# Altium schematic sheet esp32_v2.SchDoc
size A3
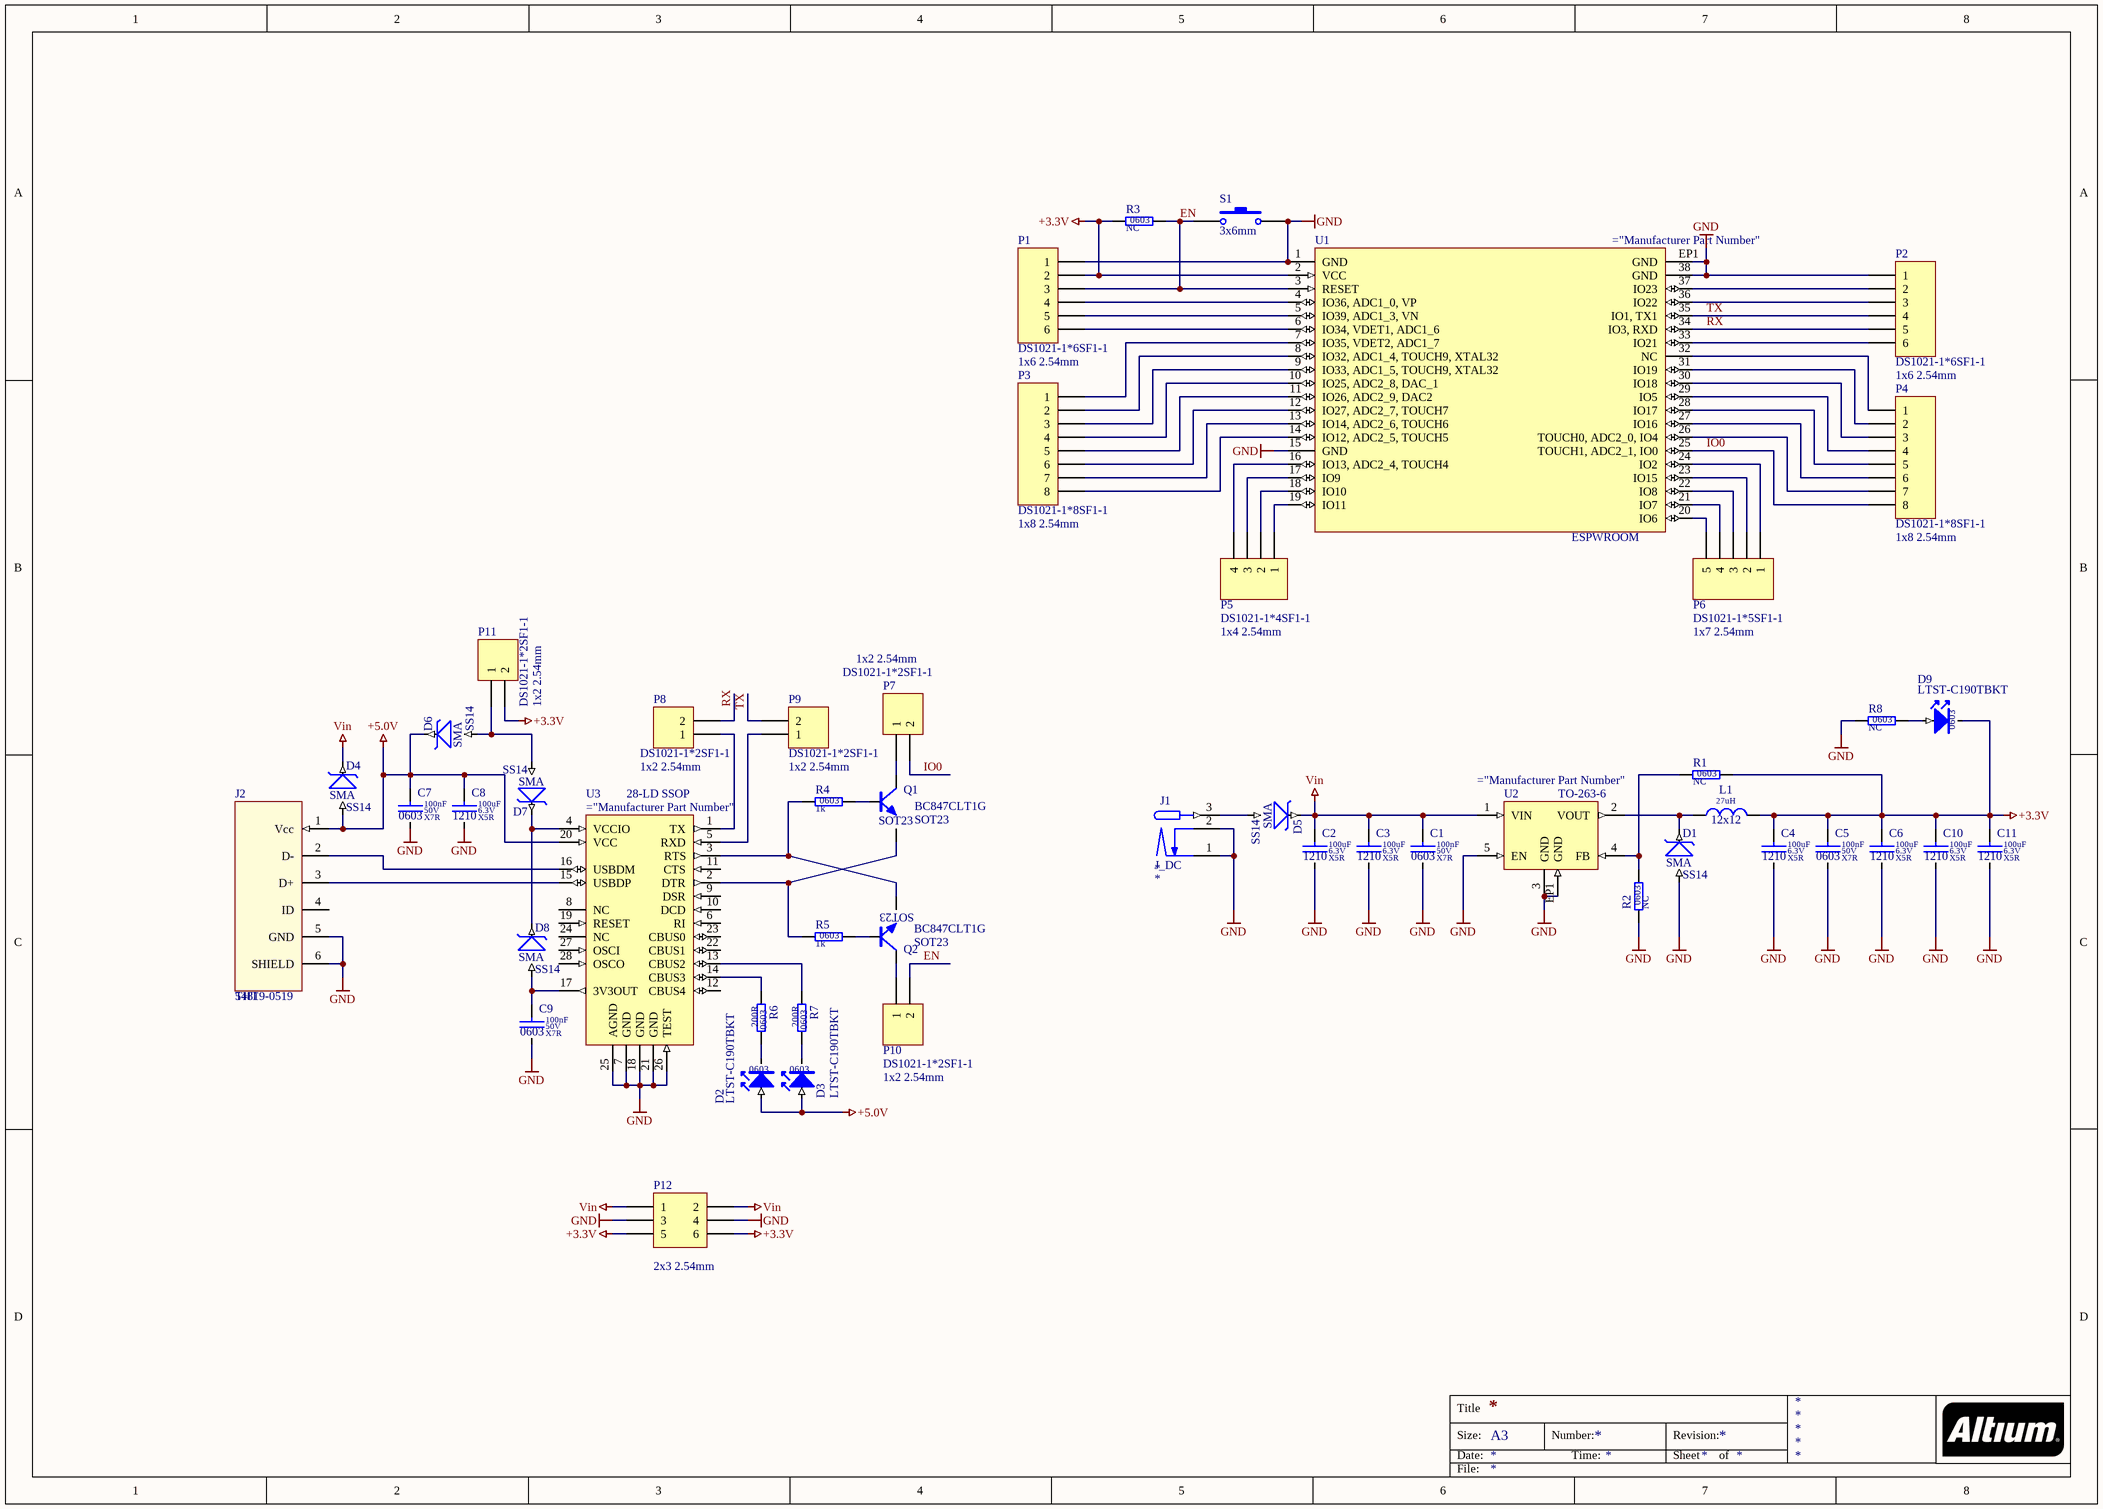
[diagram p0: esp32_v2.SchDoc]

## Parts
C1  value 100nF  Dielectric: X7R  Voltage: 50V  SCH_Footprint: 0603  [C_0603_1608]  (hidden comment: Ceramic X7R)
C2  value 100uF  Dielectric: X5R  Voltage: 6.3V  SCH_Footprint: 1210  [C_1210_3225]  (hidden comment: Ceramic X5R)
C3  value 100uF  Dielectric: X5R  Voltage: 6.3V  SCH_Footprint: 1210  [C_1210_3225]  (hidden comment: Ceramic X5R)
C4  value 100uF  Dielectric: X5R  Voltage: 6.3V  SCH_Footprint: 1210  [C_1210_3225]  (hidden comment: Ceramic X5R)
C5  value 100nF  Dielectric: X7R  Voltage: 50V  SCH_Footprint: 0603  [C_0603_1608]  (hidden comment: Ceramic X7R)
C6  value 100uF  Dielectric: X5R  Voltage: 6.3V  SCH_Footprint: 1210  [C_1210_3225]  (hidden comment: Ceramic X5R)
C7  value 100nF  Dielectric: X7R  Voltage: 50V  SCH_Footprint: 0603  [C_0603_1608]  (hidden comment: Ceramic X7R)
C8  value 100uF  Dielectric: X5R  Voltage: 6.3V  SCH_Footprint: 1210  [C_1210_3225]  (hidden comment: Ceramic X5R)
C9  value 100nF  Dielectric: X7R  Voltage: 50V  SCH_Footprint: 0603  [C_0603_1608]  (hidden comment: Ceramic X7R)
C10  value 100uF  Dielectric: X5R  Voltage: 6.3V  SCH_Footprint: 1210  [C_1210_3225]  (hidden comment: Ceramic X5R)
C11  value 100uF  Dielectric: X5R  Voltage: 6.3V  SCH_Footprint: 1210  [C_1210_3225]  (hidden comment: Ceramic X5R)
D1  SCH_Footprint: SMA  [SMA_DO-214AC]  (hidden comment: SS14)
D2  value LTST-C190TBKT  SCH_Footprint: 0603  [OL_0603_1608]  (hidden comment: Blue Led)
D3  value LTST-C190TBKT  SCH_Footprint: 0603  [OL_0603_1608]  (hidden comment: Blue Led)
D4  SCH_Footprint: SMA  [SMA_DO-214AC]  (hidden comment: SS14)
D5  SCH_Footprint: SMA  [SMA_DO-214AC]  (hidden comment: SS14)
D6  SCH_Footprint: SMA  [SMA_DO-214AC]  (hidden comment: SS14)
D7  SCH_Footprint: SMA  [SMA_DO-214AC]  (hidden comment: SS14)
D8  SCH_Footprint: SMA  [SMA_DO-214AC]  (hidden comment: SS14)
D9  value LTST-C190TBKT  SCH_Footprint: 0603  [OL_0603_1608]  (hidden comment: Blue Led)
J1  J_DC  [DC_5.5]
J2  value 54819-0519  SCH_Footprint: THT  [J_USB_MINIB_54819-0519_THT]  (hidden comment: USB connector)
L1  value 27uH  SCH_Footprint: 12x12  [L_SRR1280-XXXY]  (hidden comment: Inductor)
P1  value DS1021-1*6SF1-1  SCH_Footprint: 1x6 2.54mm  [P_HEADER_1x6_2.54]  (hidden comment: Goldpin)
P2  value DS1021-1*6SF1-1  SCH_Footprint: 1x6 2.54mm  [P_HEADER_1x6_2.54]  (hidden comment: Goldpin)
P3  value DS1021-1*8SF1-1  SCH_Footprint: 1x8 2.54mm  [P_HEADER_1x8_2.54]  (hidden comment: Goldpin)
P4  value DS1021-1*8SF1-1  SCH_Footprint: 1x8 2.54mm  [P_HEADER_1x8_2.54]  (hidden comment: Goldpin)
P5  value DS1021-1*4SF1-1  SCH_Footprint: 1x4 2.54mm  [P_HEADER_1x4_2.54]  (hidden comment: Goldpin)
P6  value DS1021-1*5SF1-1  SCH_Footprint: 1x7 2.54mm  [P_HEADER_1x5_2.54]  (hidden comment: Goldpin)
P7  value DS1021-1*2SF1-1  SCH_Footprint: 1x2 2.54mm  [P_HEADER_1x2_2.54]  (hidden comment: Goldpin)
P8  value DS1021-1*2SF1-1  SCH_Footprint: 1x2 2.54mm  [P_HEADER_1x2_2.54]  (hidden comment: Goldpin)
P9  value DS1021-1*2SF1-1  SCH_Footprint: 1x2 2.54mm  [P_HEADER_1x2_2.54]  (hidden comment: Goldpin)
P10  value DS1021-1*2SF1-1  SCH_Footprint: 1x2 2.54mm  [P_HEADER_1x2_2.54]  (hidden comment: Goldpin)
P11  value DS1021-1*2SF1-1  SCH_Footprint: 1x2 2.54mm  [P_HEADER_1x2_2.54]  (hidden comment: Goldpin)
P12  SCH_Footprint: 2x3 2.54mm  [P_HEADER_2x3_2.54]  (hidden comment: Goldpin)
Q1  value BC847CLT1G  SCH_Footprint: SOT23  [SOT23_TO236_SC59]  (hidden comment: BC847C)
Q2  value BC847CLT1G  SCH_Footprint: SOT23  [SOT23_TO236_SC59]  (hidden comment: BC847C)
R1  value NC  SCH_Footprint: 0603  [R_NC_0603_1608]  (hidden comment: Resistor)
R2  value NC  SCH_Footprint: 0603  [R_NC_0603_1608]  (hidden comment: Resistor)
R3  value NC  SCH_Footprint: 0603  [R_NC_0603_1608]  (hidden comment: Resistor)
R4  value 1k  SCH_Footprint: 0603  [R_0603_1608]  (hidden comment: Resistor)
R5  value 1k  SCH_Footprint: 0603  [R_0603_1608]  (hidden comment: Resistor)
R6  value 200R  SCH_Footprint: 0603  [R_0603_1608]  (hidden comment: Resistor)
R7  value 200R  SCH_Footprint: 0603  [R_0603_1608]  (hidden comment: Resistor)
R8  value NC  SCH_Footprint: 0603  [R_NC_0603_1608]  (hidden comment: Resistor)
S1  3x6mm  [S_TACTSWITCH3x6]
U1  SCH_Footprint: ESPWROOM  [ESP_WROOM_32]  (hidden comment: U_ESP32)
U2  VR_LM2596  [TO-263-6]  (value not drawn)
U3  SCH_Footprint: 28-LD SSOP  [SSOP28_5X10X17]  (hidden comment: U_FT232RL)

## Nets
+3.3V: C4.1 C5.1 C6.1 C10.1 C11.1 D9.1(K) L1.2 P1.2 P11.2 P12.5 P12.6 R1.2 R3.1 U1.2(VCC)
+5.0V: C7.1 C8.1 D2.2(A) D3.2(A) D4.2 D6.1 J2.1(Vcc) U3.20(VCC)
GND: C1.2 C2.2 C3.2 C4.2 C5.2 C6.2 C7.2 C8.2 C9.2 C10.2 C11.2 D1.2 J1.1 J1.2 J2.5(GND) J2.6(SHIELD) P1.1 P2.1 P12.3 P12.4 R2.1 R8.1 S1.2 U1.1(GND) U1.15(GND) U1.38(GND) U1.EP1(GND) U2.3(GND) U2.5(EN) U2.EP1(GND) U3.7(GND) U3.18(GND) U3.21(GND) U3.25(AGND) U3.26(TEST)
Vin: C1.1 C2.1 C3.1 D4.1 D5.1 P12.1 P12.2 U2.1(VIN)
EN: P1.3 P10.2 R3.2 S1.1 U1.3(RESET)
IO0: P4.8 P7.2 U1.25(TOUCH1,_ADC2_1,_IO0)
RX: P2.5 P8.2 U1.34(IO3,_RXD)
TX: P2.4 P9.2 U1.35(IO1,_TX1)
NetC9_1: C9.1 D8.2 U3.17(3V3OUT)
NetD1_1: D1.1 L1.1 U2.2(VOUT)
NetD2_1: D2.1(K) R6.2
NetD3_1: D3.1(K) R7.2
NetD5_2: D5.2 J1.3
NetD6_2: D6.2 D7.2 P11.1
NetD7_1: D7.1 D8.1 U3.4(VCCIO)
NetD9_2: D9.2(A) R8.2
NetJ2_2: J2.2(D-) U3.16(USBDM)
NetJ2_3: J2.3(D+) U3.15(USBDP)
NetP1_4: P1.4 U1.4(IO36,_ADC1_0,_VP)
NetP1_5: P1.5 U1.5(IO39,_ADC1_3,_VN)
NetP1_6: P1.6 U1.6(IO34,_VDET1,_ADC1_6)
NetP2_2: P2.2 U1.37(IO23)
NetP2_3: P2.3 U1.36(IO22)
NetP2_6: P2.6 U1.33(IO21)
NetP3_1: P3.1 U1.7(IO35,_VDET2,_ADC1_7)
NetP3_2: P3.2 U1.8(IO32,_ADC1_4,_TOUCH9,_XTAL32)
NetP3_3: P3.3 U1.9(IO33,_ADC1_5,_TOUCH9,_XTAL32)
NetP3_4: P3.4 U1.10(IO25,_ADC2_8,_DAC_1)
NetP3_5: P3.5 U1.11(IO26,_ADC2_9,_DAC2)
NetP3_6: P3.6 U1.12(IO27,_ADC2_7,_TOUCH7)
NetP3_7: P3.7 U1.13(IO14,_ADC2_6,_TOUCH6)
NetP3_8: P3.8 U1.14(IO12,_ADC2_5,_TOUCH5)
NetP4_1: P4.1 U1.32(NC)
NetP4_2: P4.2 U1.31(IO19)
NetP4_3: P4.3 U1.30(IO18)
NetP4_4: P4.4 U1.29(IO5)
NetP4_5: P4.5 U1.28(IO17)
NetP4_6: P4.6 U1.27(IO16)
NetP4_7: P4.7 U1.26(TOUCH0,_ADC2_0,_IO4)
NetP5_1: P5.1 U1.19(IO11)
NetP5_2: P5.2 U1.18(IO10)
NetP5_3: P5.3 U1.17(IO9)
NetP5_4: P5.4 U1.16(IO13,_ADC2_4,_TOUCH4)
NetP6_1: P6.1 U1.24(IO2)
NetP6_2: P6.2 U1.23(IO15)
NetP6_3: P6.3 U1.22(IO8)
NetP6_4: P6.4 U1.21(IO7)
NetP6_5: P6.5 U1.20(IO6)
NetP7_1: P7.1 Q1.3(C)
NetP8_1: P8.1 U3.1(TX)
NetP9_1: P9.1 U3.5(RXD)
NetP10_1: P10.1 Q2.3(C)
NetQ1_1: Q1.1(B) R4.2
NetQ1_2: Q1.2(E) R5.1 U3.2(DTR)
NetQ2_1: Q2.1(B) R5.2
NetQ2_2: Q2.2(E) R4.1 U3.3(RTS)
NetR1_1: R1.1 R2.2 U2.4(FB)
NetR6_1: R6.1 U3.14(CBUS3)
NetR7_1: R7.1 U3.13(CBUS2)

Not connected (* = marked no-connect by the designer): J2 4(ID); U3 6(RI) 8(NC) 9(DSR) 10(DCD) 11(CTS) 12(CBUS4) 19(RESET) 22(CBUS1) 23(CBUS0) 24(NC) 27(OSCI) 28(OSCO)

## Notes on the sheet
- Title
- Size:
- Date:
- A3
- Number:
- Time:
- Revision:
- Sheet
- of
- File:

## Library data of the parts
C1 C5 C7 C9 = C_100nF_50V_X7R_0603_5: Capacitor; Manufacturer: Samsung; Manufacturer Part Number: CL10B104JB8NNNC; Tolerance (%): 5; Part Number: C_100nF_50V_X7R_0603_5; HelpURL: http://www.tme.eu/pl/Document/4a42202b32dab16128fe107dd69598cc/samsung-chip-cap.pdf; Supplier 1: TME; Supplier Part Number 1: CL10B104JB8NNNC; Supplier 2: RS Components; Supplier 3: Farnell; Supplier 4: Mouser; Supplier 5: Digi-Key
C2-C4 C6 C8 C10 C11 = C_100uF_6.3V_X5R_1210_20: Capacitor; Manufacturer: TDK; Manufacturer Part Number: C3225X5R0J107M250AC; Tolerance (%): 20; Part Number: C_100uF_6.3V_X5R_1210_20; HelpURL: https://datasheet.octopart.com/C3225X5R0J107M250AC-TDK-datasheet-41194876.pdf; Supplier 1: TME; Supplier 2: RS Components; Supplier Part Number 2: 7407685P; Supplier 3: Farnell; Supplier Part Number 3: 2522162; Supplier 4: Mouser; Supplier Part Number 4: 810-C3225X5R0J107M; Supplier 5: Digi-Key; Supplier Part Number 5: 445-1437-1-ND
D1 D4-D8 = DS_SS14_1A_40V_SMA: Manufacturer: Fairchild Semiconductor; Voltage: 40V; Current: 1A; Value: SS14; Part Number: DS_SS14_1A_40V_SMA; HelpURL: https://www.vishay.com/docs/88746/ss12.pdf; Manufacturer Part Number: SS14; Supplier 1: TME; Supplier 2: RS Components; Supplier 3: Farnell; Supplier 4: Mouser; Supplier Part Number 4: 512-SS14; Supplier 5: Digi-Key; Supplier Part Number 5: SS14CT
D2 D3 D9 = OL_B_0603: LED_BLUE; Manufacturer: Lite-On; Part Number: OL_B_0603; HelpURL: https://datasheet.octopart.com/LTST-C190TBKT-Lite-On-datasheet-158557.pdf; Manufacturer Part Number: LTST-C190TBKT; Supplier 1: TME; Supplier Part Number 1: LTST-C190TBKT; Supplier 2: RS Components; Supplier Part Number 2: 6920994P; Supplier 3: Farnell; Supplier 4: Mouser; Supplier Part Number 4: 859-LTST-C190TBKT; Supplier 5: Digi-Key; Supplier Part Number 5: 160-1646-1-ND
J1 = J_DC_5.5mm: Value: *; SCH_Footprint: *; Part Number: J_DC_5.5mm; Supplier 1: TME; Supplier 2: RS Components; Supplier 3: Farnell; Supplier 4: Mouser; Supplier 5: Digi-Key
J2 = J_USB_MINIB_54819-0519: Złącze USB, Mini USB typu B, USB 2.0 OTG, Montaż przewlekany; Manufacturer: Molex; Part Number: J_USB_MINIB_54819-0519; Component Type: Standard; HelpURL: http://www.molex.com/pdm_docs/sd/548190519_sd.pdf; Manufacturer Part Number: 54819-0519; Supplier 1: TME; Supplier Part Number 1: MX-54819-0519; Supplier 2: RS Components; Supplier Part Number 2: 5152005P; Supplier 3: Farnell; Supplier Part Number 3: 9786465; Supplier 4: Mouser; Supplier Part Number 4: 538-54819-0519; Supplier 5: Digi-Key
L1 = L_27uH_3.9A_SRR1280: Induction; Manufacturer: Bourns; Manufacturer Part Number: SRR1280-270M; Current: 3.9A; Resistance: 52mR; Part Number: L_27uH_3.9A_SRR1280; HelpURL: https://www.bourns.com/pdfs/SRR1280.pdf; Supplier 1: TME; Supplier 2: RS Components; Supplier Part Number 2: 8749766P; Supplier 3: Farnell; Supplier Part Number 3: 2333859; Supplier 4: Mouser; Supplier Part Number 4: 652-SRR1280-270M; Supplier 5: Digi-Key
P1 P2 = P_HEADER_1x6_2.54: Header, 6-Pin; Manufacturer: Connfly; Part Number: P_HEADER_1x6_2.54; Component Type: Standard; HelpURL: http://www.tme.eu/en/Document/cc301e58a5da78cb543a94b5a5b7f06a/DS1021.pdf; Manufacturer Part Number: DS1021-1*6SF1-1; Supplier 1: TME; Supplier Part Number 1: ZL201-06G; Supplier 2: RS Components; Supplier 3: Farnell; Supplier 4: Mouser; Supplier 5: Digi-Key
P3 P4 = P_HEADER_1x8_2.54: Header, 8-Pin; Manufacturer: Connfly; Part Number: P_HEADER_1x8_2.54; Component Type: Standard; HelpURL: http://www.tme.eu/en/Document/cc301e58a5da78cb543a94b5a5b7f06a/DS1021.pdf; Manufacturer Part Number: DS1021-1*8SF1-1; Supplier 1: TME; Supplier Part Number 1: ZL201-08G; Supplier 2: RS Components; Supplier 3: Farnell; Supplier 4: Mouser; Supplier 5: Digi-Key
P5 = P_HEADER_1x4_2.54: Header, 4-Pin; Manufacturer: Connfly; Part Number: P_HEADER_1x4_2.54; Component Type: Standard; HelpURL: http://datasheet.octopart.com/DS1021-1%2A4SF1-1-Connfly-datasheet-65537859.pdf; Manufacturer Part Number: DS1021-1*4SF1-1; Supplier 1: TME; Supplier Part Number 1: ZL201-04G; Supplier 2: RS Components; Supplier 3: Farnell; Supplier 4: Mouser; Supplier 5: Digi-Key
P6 = P_HEADER_1x5_2.54: Header, 5-Pin; Manufacturer: Connfly; Part Number: P_HEADER_1x5_2.54; Component Type: Standard; HelpURL: http://datasheet.octopart.com/DS1021-1%2A5SF1-1-Connfly-datasheet-65537859.pdf; Manufacturer Part Number: DS1021-1*5SF1-1; Supplier 1: TME; Supplier Part Number 1: ZL201-05G; Supplier 2: RS Components; Supplier 3: Farnell; Supplier 4: Mouser; Supplier 5: Digi-Key
P7-P11 = P_HEADER_1x2_2.54: Header, 2-Pin; Manufacturer: Connfly; Part Number: P_HEADER_1x2_2.54; Component Type: Standard; HelpURL: http://www.tme.eu/en/Document/cc301e58a5da78cb543a94b5a5b7f06a/DS1021.pdf; Manufacturer Part Number: DS1021-1*2SF1-1; Supplier 1: TME; Supplier Part Number 1: ZL201-02G; Supplier 2: RS Components; Supplier 3: Farnell; Supplier 4: Mouser; Supplier 5: Digi-Key
P12 = P_HEADER_2x3_2.54: Header, 3-Pin, Dual row; Part Number: P_HEADER_2x3_2.54; Component Type: Standard; Supplier 1: TME; Supplier 2: RS Components; Supplier 3: Farnell; Supplier 4: Mouser; Supplier 5: Digi-Key
Q1 Q2 = QNP_BC847C_45V_0A1: Manufacturer: ON Semiconductor; Type: NPN; Voltage: 45V; Current: 0A1; Part Number: QNP_BC847C_45V_0A1; HelpURL: https://assets.nexperia.com/documents/data-sheet/BC847_SER.pdf; Manufacturer Part Number: BC847CLT1G; Supplier 1: TME; Supplier Part Number 1: BC847CLT1G; Supplier 2: RS Components; Supplier 3: Farnell; Supplier 4: Mouser; Supplier 5: Digi-Key; Supplier Part Number 5: BC847CLT1GOSCT-ND
R1-R3 R8 = R_GENERIC_0603: Part Number: R_GENERIC_0603; Supplier 1: TME; Supplier 2: RS Components; Supplier 3: Farnell; Supplier 4: Mouser; Supplier 5: Digi-Key
R4 R5 = R_1k_0603_1: Manufacturer: Vishay; Manufacturer Part Number: CRCW06031K00FKEA; Voltage: 75V; Power: 100mW; Tolerance: 1%; Part Number: R_1k_0603_1; HelpURL: http://www.farnell.com/datasheets/2310790.pdf?_ga=2.256888843.1690599162.1548417389-1379097396.1542296996&_gac=1.262631934.1547230258.Cj0KCQiAmuHhBRD0ARIsAFWyPwhX8HcvXnM3tA0ZBodZLzDIjH2ZxLpjT5LWo9bad_HPRbU8LfPq44UaAhEwEALw_wcB; Supplier 1: TME; Supplier 2: RS Components; Supplier Part Number 2: 678-9875P; Supplier 3: Farnell; Supplier Part Number 3: 1469740; Supplier 4: Mouser; Supplier Part Number 4: 71-CRCW0603-1.0K-E3; Supplier 5: Digi-Key; Supplier Part Number 5: 541-1.00KHCT-ND
R6 R7 = R_200R_0603_1: Manufacturer: Royalohm; Manufacturer Part Number: 0603SAF2000T5E; Voltage: 50V; Power: 100mW; Tolerance: 1%; Part Number: R_200R_0603_1; HelpURL: http://www.tme.eu/pl/Document/b315665a56acbc42df513c99b390ad98/ROYALOHM-THICKFILM.pdf; Supplier 1: TME; Supplier Part Number 1: SMD0603-200R-1%; Supplier 2: RS Components; Supplier 3: Farnell; Supplier 4: Mouser; Supplier Part Number 4: 667-ERJ-3EKF2000V; Supplier 5: Digi-Key; Supplier Part Number 5: P200HCT-ND
S1 = S_TACTSWITCH: Tact Switch; Manufacturer: Ninigi; Manufacturer Part Number: TACTM-34N-F; Part Number: S_TACTSWITCH; SCH_Footprint: 3x6mm; HelpURL: http://pl.ninigi.com/product/tactm-34n-f/pdf; Supplier 1: TME; Supplier Part Number 1: TACTM-34N-F; Supplier 2: RS Components; Supplier 3: Farnell; Supplier 4: Mouser; Supplier 5: Digi-Key
U1 = M_ESP32_WROOM: Value: ="Manufacturer Part Number"; Part Number: M_ESP32_WROOM; Supplier 1: TME; Supplier 2: RS Components; Supplier 3: Farnell; Supplier 4: Mouser; Supplier 5: Digi-Key
U2 = VR_LM2596-ADJ: Value: ="Manufacturer Part Number"; SCH_Footprint: TO-263-6; Part Number: VR_LM2596-ADJ; Supplier 1: TME; Supplier 2: RS Components; Supplier 3: Farnell; Supplier 4: Mouser; Supplier 5: Digi-Key
U3 = U_FT232RLR: Value: ="Manufacturer Part Number"; Part Number: U_FT232RLR; Supplier 1: TME; Supplier 2: RS Components; Supplier 3: Farnell; Supplier 4: Mouser; Supplier 5: Digi-Key